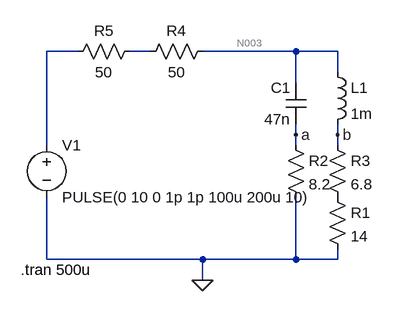
[diagram p0: schematic 2_1.asc]
2_1.asc, the LTspice schematic file:
Version 4.1
SHEET 1 880 680
WIRE 128 -32 80 -32
WIRE 240 -32 208 -32
WIRE 464 -32 320 -32
WIRE 528 -32 464 -32
WIRE 528 0 528 -32
WIRE 464 16 464 -32
WIRE 464 96 464 80
WIRE 528 96 528 80
WIRE 80 112 80 -32
WIRE 464 112 464 96
WIRE 528 112 528 96
WIRE 80 288 80 192
WIRE 320 288 80 288
WIRE 464 288 464 192
WIRE 464 288 320 288
WIRE 528 288 528 272
WIRE 528 288 464 288
WIRE 320 320 320 288
FLAG 320 320 0
FLAG 464 96 a
FLAG 528 96 b
SYMBOL voltage 80 96 R0
WINDOW 123 0 0 Left 0
WINDOW 39 0 0 Left 0
SYMATTR InstName V1
SYMATTR Value PULSE(0 10 0 1p 1p 100u 200u 10)
SYMBOL cap 480 80 R180
WINDOW 0 24 56 Left 2
WINDOW 3 24 8 Left 2
SYMATTR InstName C1
SYMATTR Value 47n
SYMBOL ind 512 -16 R0
SYMATTR InstName L1
SYMATTR Value 1m
SYMATTR SpiceLine Rser=1m
SYMBOL res 448 96 R0
SYMATTR InstName R2
SYMATTR Value 8.2
SYMBOL res 512 96 R0
SYMATTR InstName R3
SYMATTR Value 6.8
SYMBOL res 336 -48 R90
WINDOW 0 0 56 VBottom 2
WINDOW 3 32 56 VTop 2
SYMATTR InstName R4
SYMATTR Value 50
SYMBOL res 224 -48 R90
WINDOW 0 0 56 VBottom 2
WINDOW 3 32 56 VTop 2
SYMATTR InstName R5
SYMATTR Value 50
SYMBOL res 512 176 R0
SYMATTR InstName R1
SYMATTR Value 14
TEXT 40 304 Left 2 !.tran 500u

The netlist it stands for:
* 2_1.asc
V1 N001 0 PULSE(0 10 0 1p 1p 100u 200u 10)
C1 a N003 47n
L1 N003 b 1m Rser=1m
R2 a 0 8.2
R3 b P001 6.8
R4 N003 N002 50
R5 N002 N001 50
R1 P001 0 14
.tran 500u
.backanno
.end

* Results of the author's LTspice run, read from the files saved beside the schematic
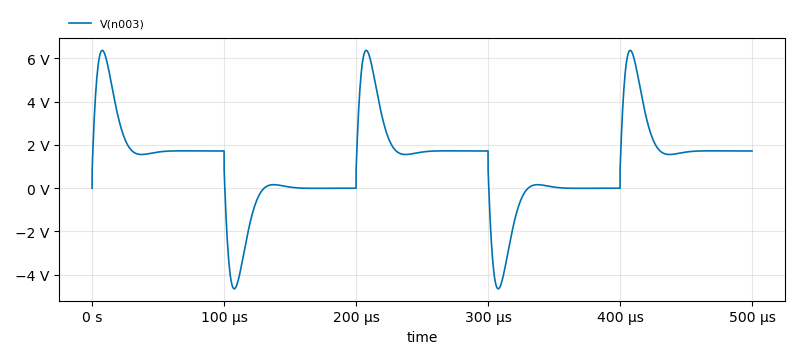
[diagram p1: Transient Analysis of 2_1.asc, plotted from the saved traces]
* Transient Analysis, 1 run:
*   V(n003): min -4.653 V, max 6.375 V, average 1.167 V, rms 2.36 V, last 1.722 V